# Altium schematic sheet SMARC Pinout-3.SchDoc
size A4; SheetNumber: 5; SheetTotal: 8
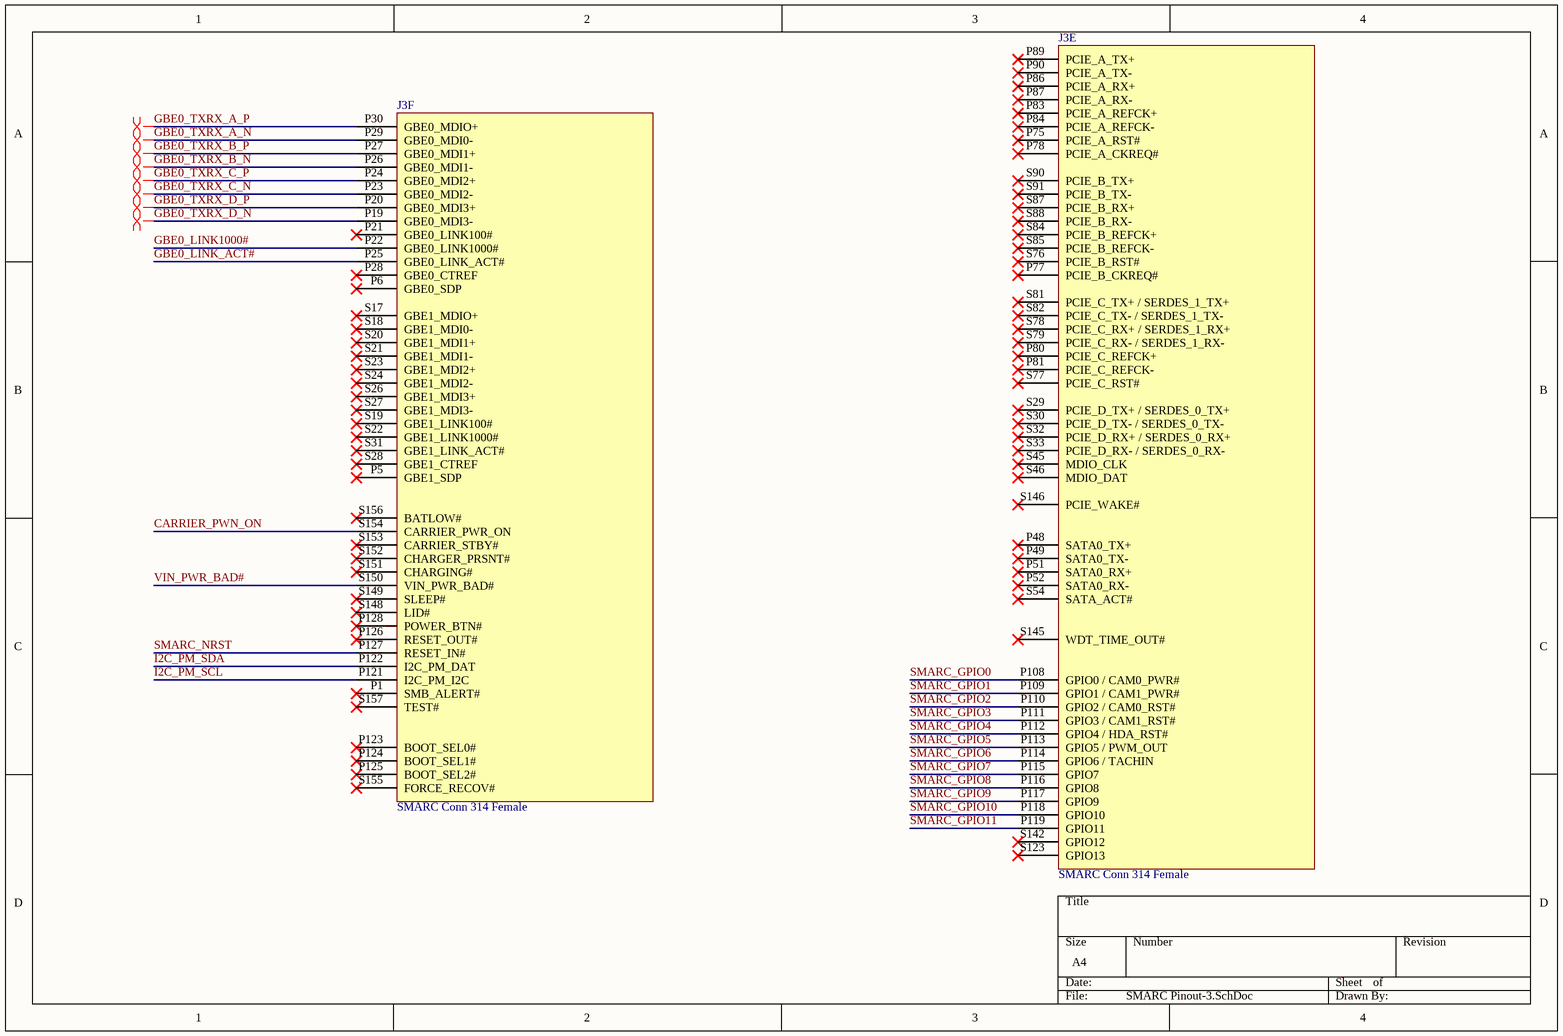
[diagram p0: SMARC Pinout-3.SchDoc]

## Parts
J3  SMARC Conn 314 Female  [SMARC 314 Female]  (parts E,F of 6)

## Nets
CARRIER_PWN_ON: J3.S154(CARRIER_PWR_ON)
GBE0_LINK1000#: J3.P22(GBE0_LINK1000#)
GBE0_LINK_ACT#: J3.P25(GBE0_LINK_ACT#)
GBE0_TXRX_A_N: J3.P29(GBE0_MDI0-)
GBE0_TXRX_A_P: J3.P30(GBE0_MDIO+)
GBE0_TXRX_B_N: J3.P26(GBE0_MDI1-)
GBE0_TXRX_B_P: J3.P27(GBE0_MDI1+)
GBE0_TXRX_C_N: J3.P23(GBE0_MDI2-)
GBE0_TXRX_C_P: J3.P24(GBE0_MDI2+)
GBE0_TXRX_D_N: J3.P19(GBE0_MDI3-)
GBE0_TXRX_D_P: J3.P20(GBE0_MDI3+)
I2C_PM_SCL: J3.P121(I2C_PM_I2C)
I2C_PM_SDA: J3.P122(I2C_PM_DAT)
SMARC_GPIO0: J3.P108(GPIO0_/_CAM0_PWR#)
SMARC_GPIO1: J3.P109(GPIO1_/_CAM1_PWR#)
SMARC_GPIO2: J3.P110(GPIO2_/_CAM0_RST#)
SMARC_GPIO3: J3.P111(GPIO3_/_CAM1_RST#)
SMARC_GPIO4: J3.P112(GPIO4_/_HDA_RST#)
SMARC_GPIO5: J3.P113(GPIO5_/_PWM_OUT)
SMARC_GPIO6: J3.P114(GPIO6_/_TACHIN)
SMARC_GPIO7: J3.P115(GPIO7)
SMARC_GPIO8: J3.P116(GPIO8)
SMARC_GPIO9: J3.P117(GPIO9)
SMARC_GPIO10: J3.P118(GPIO10)
SMARC_GPIO11: J3.P119(GPIO11)
SMARC_NRST: J3.P127(RESET_IN#)
VIN_PWR_BAD#: J3.S150(VIN_PWR_BAD#)

Not connected (* = marked no-connect by the designer): J3 P1(SMB_ALERT#)* P5(GBE1_SDP)* P6(GBE0_SDP)* P21(GBE0_LINK100#)* P28(GBE0_CTREF)* P48(SATA0_TX+)* P49(SATA0_TX-)* P51(SATA0_RX+)* P52(SATA0_RX-)* P75(PCIE_A_RST#)* P77(PCIE_B_CKREQ#)* P78(PCIE_A_CKREQ#)* P80(PCIE_C_REFCK+)* P81(PCIE_C_REFCK-)* P83(PCIE_A_REFCK+)* P84(PCIE_A_REFCK-)* P86(PCIE_A_RX+)* P87(PCIE_A_RX-)* P89(PCIE_A_TX+)* P90(PCIE_A_TX-)* P123(BOOT_SEL0#)* P124(BOOT_SEL1#)* P125(BOOT_SEL2#)* P126(RESET_OUT#)* P128(POWER_BTN#)* S17(GBE1_MDIO+)* S18(GBE1_MDI0-)* S19(GBE1_LINK100#)* S20(GBE1_MDI1+)* S21(GBE1_MDI1-)* S22(GBE1_LINK1000#)* S23(GBE1_MDI2+)* S24(GBE1_MDI2-)* S26(GBE1_MDI3+)* S27(GBE1_MDI3-)* S28(GBE1_CTREF)* S29(PCIE_D_TX+_/_SERDES_0_TX+)* S30(PCIE_D_TX-_/_SERDES_0_TX-)* S31(GBE1_LINK_ACT#)* S32(PCIE_D_RX+_/_SERDES_0_RX+)* S33(PCIE_D_RX-_/_SERDES_0_RX-)* S45(MDIO_CLK)* S46(MDIO_DAT)* S54(SATA_ACT#)* S76(PCIE_B_RST#)* S77(PCIE_C_RST#)* S78(PCIE_C_RX+_/_SERDES_1_RX+)* S79(PCIE_C_RX-_/_SERDES_1_RX-)* S81(PCIE_C_TX+_/_SERDES_1_TX+)* S82(PCIE_C_TX-_/_SERDES_1_TX-)* S84(PCIE_B_REFCK+)* S85(PCIE_B_REFCK-)* S87(PCIE_B_RX+)* S88(PCIE_B_RX-)* S90(PCIE_B_TX+)* S91(PCIE_B_TX-)* S123(GPIO13)* S142(GPIO12)* S145(WDT_TIME_OUT#)* S146(PCIE_WAKE#)* S148(LID#)* S149(SLEEP#)* S151(CHARGING#)* S152(CHARGER_PRSNT#)* S153(CARRIER_STBY#)* S155(FORCE_RECOV#)* S156(BATLOW#)* S157(TEST#)*

## Layout directives
differential pair: GBE0_TXRX_A_N, GBE0_TXRX_A_P, GBE0_TXRX_B_N, GBE0_TXRX_B_P, GBE0_TXRX_C_N, GBE0_TXRX_C_P, GBE0_TXRX_D_N, GBE0_TXRX_D_P